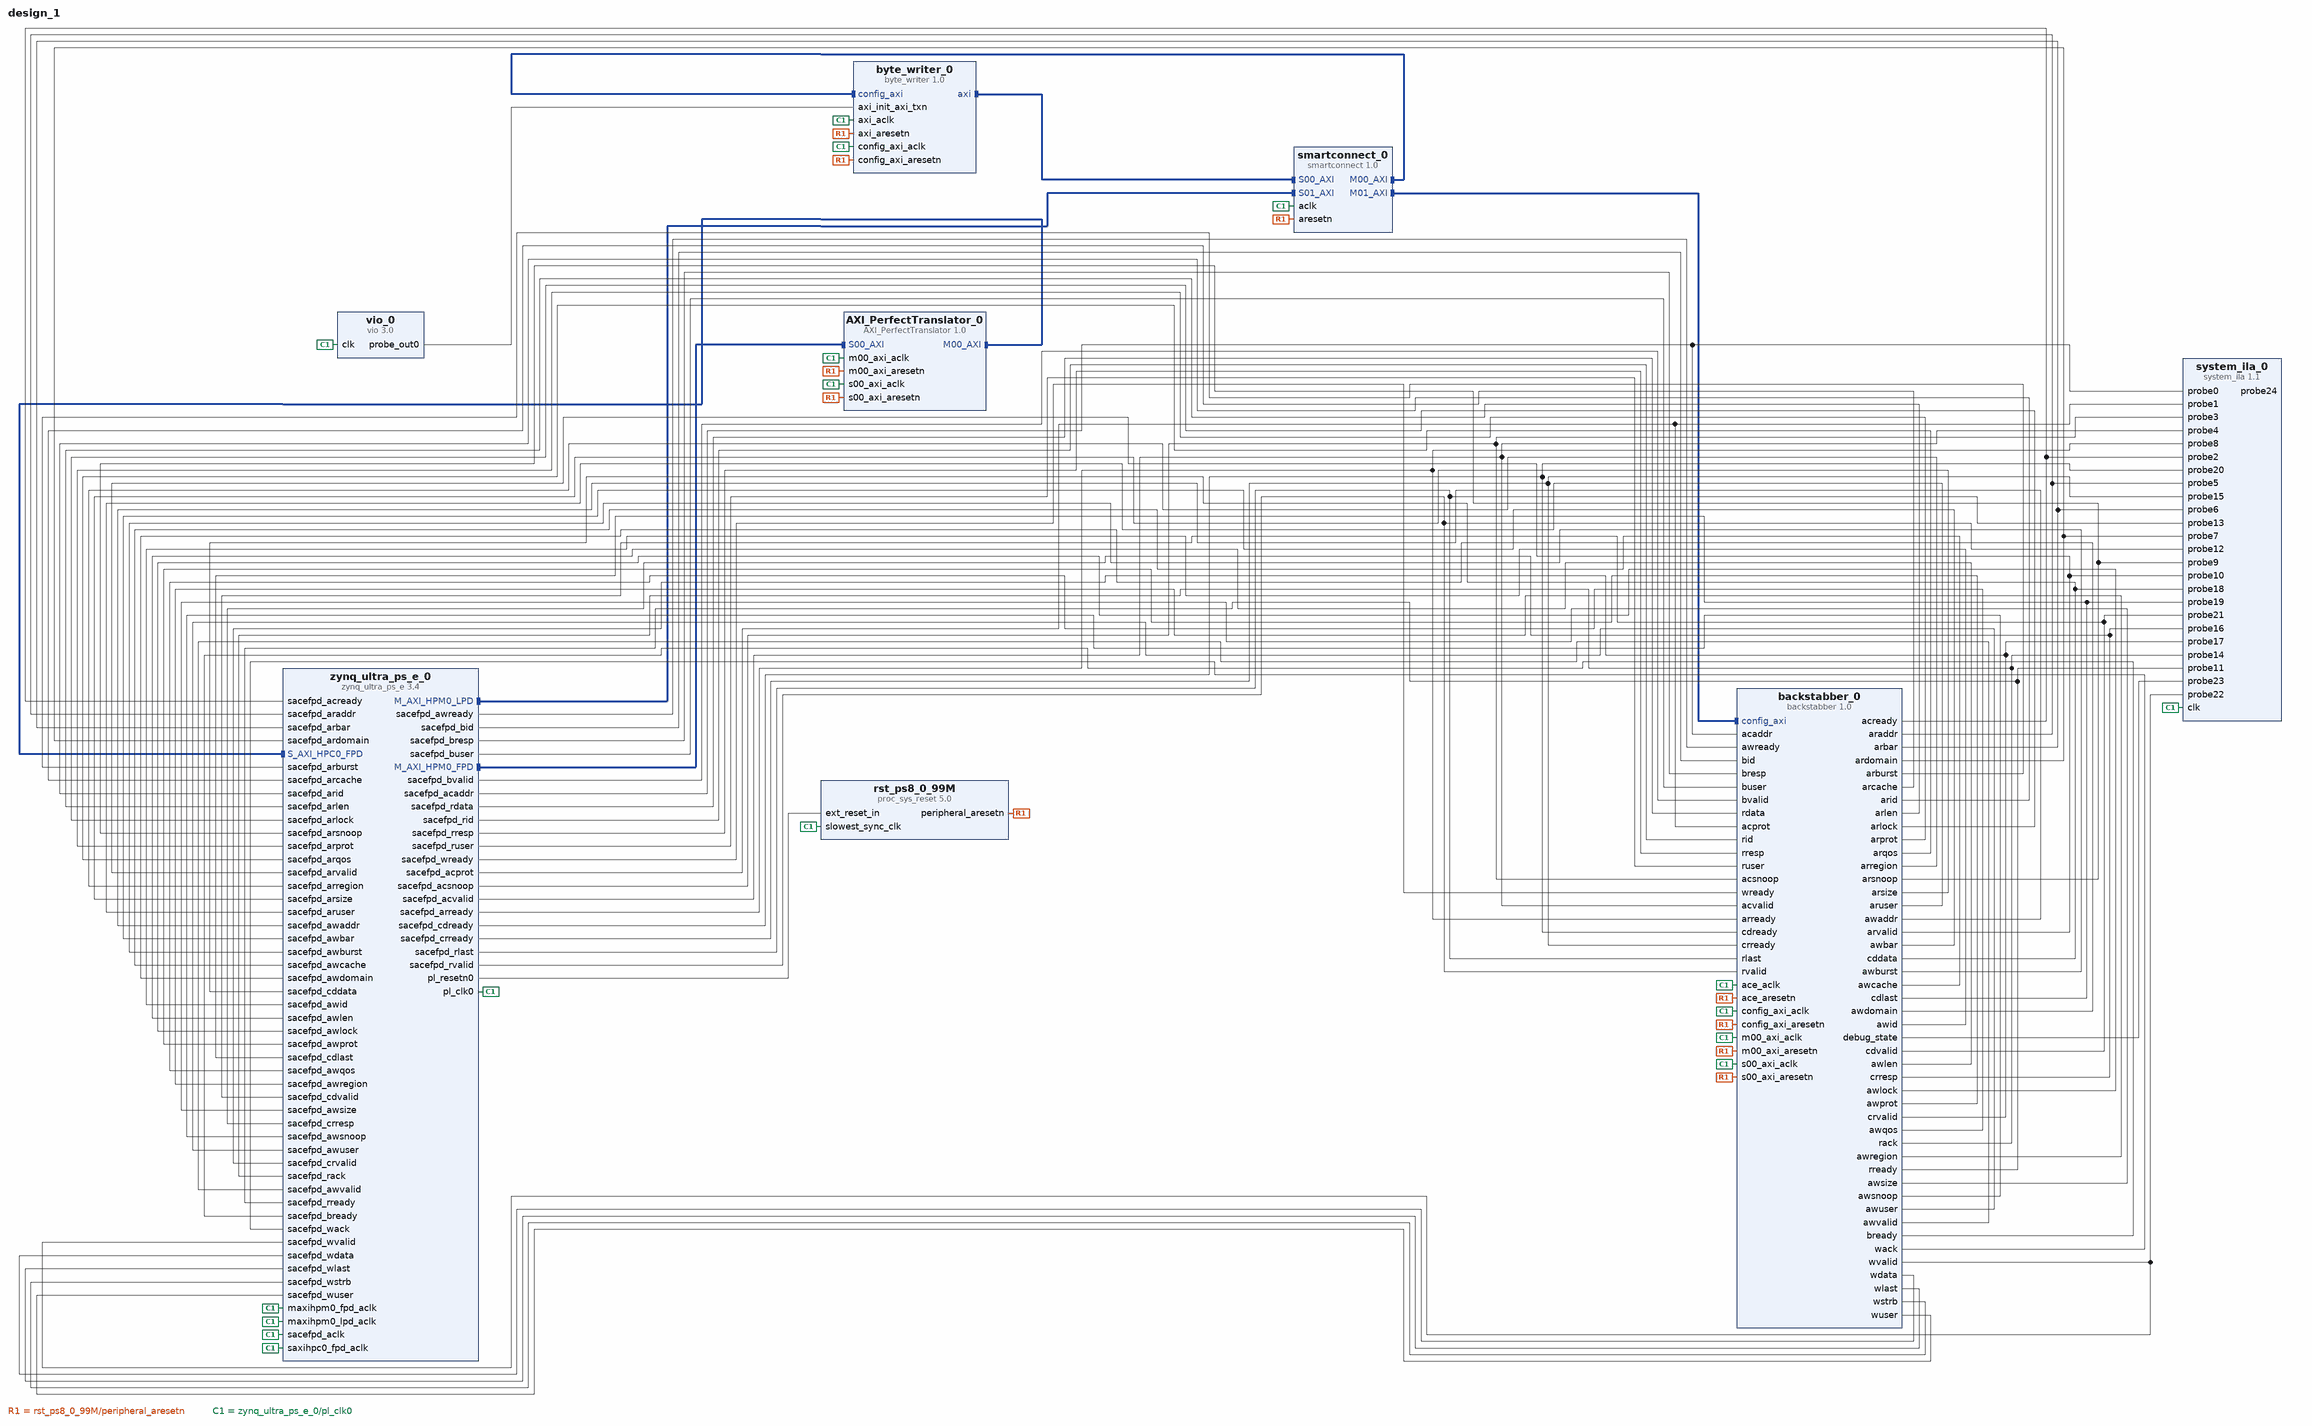
[diagram p0: block diagram of the top level]
# Vivado block design design_1, xczu9eg-ffvb1156-2-e, Vivado 2022.1
create_bd_design design_1

create_bd_cell -type ip -vlnv user.org:user:AXI_PerfectTranslator:1.0 AXI_PerfectTranslator_0
set_property -dict {CONFIG.C_M00_AXI_ID_WIDTH 6} [get_bd_cells AXI_PerfectTranslator_0]
create_bd_cell -type ip -vlnv user.org:user:backstabber:1.0 backstabber_0
set_property -dict {CONFIG.C_Config_AXI_DATA_WIDTH 128 CONFIG.QUEUE_DEPTH 2 CONFIG.WRITER 0} [get_bd_cells backstabber_0]
create_bd_cell -type ip -vlnv user.org:user:byte_writer:1.0 byte_writer_0
create_bd_cell -type ip -vlnv xilinx.com:ip:proc_sys_reset:5.0 rst_ps8_0_99M
create_bd_cell -type ip -vlnv xilinx.com:ip:smartconnect:1.0 smartconnect_0
set_property -dict {CONFIG.NUM_MI 2} [get_bd_cells smartconnect_0]
create_bd_cell -type ip -vlnv xilinx.com:ip:system_ila:1.1 system_ila_0
set_property -dict {CONFIG.C_DATA_DEPTH 65536 CONFIG.C_MON_TYPE NATIVE CONFIG.C_NUM_OF_PROBES 25} [get_bd_cells system_ila_0]
create_bd_cell -type ip -vlnv xilinx.com:ip:vio:3.0 vio_0
set_property -dict {CONFIG.C_NUM_PROBE_IN 0} [get_bd_cells vio_0]
create_bd_cell -type ip -vlnv xilinx.com:ip:zynq_ultra_ps_e:3.4 zynq_ultra_ps_e_0
set_property -dict [list \
  CONFIG.PSU_BANK_0_IO_STANDARD LVCMOS18 \
  CONFIG.PSU_BANK_1_IO_STANDARD LVCMOS18 \
  CONFIG.PSU_BANK_2_IO_STANDARD LVCMOS18 \
  CONFIG.PSU_USB3__DUAL_CLOCK_ENABLE 1 \
  CONFIG.PSU__CAN1__PERIPHERAL__ENABLE 1 \
  CONFIG.PSU__CAN1__PERIPHERAL__IO {MIO 24 .. 25} \
  CONFIG.PSU__CRF_APB__ACPU_CTRL__FREQMHZ 1200 \
  CONFIG.PSU__CRF_APB__ACPU_CTRL__SRCSEL APLL \
  CONFIG.PSU__CRF_APB__APLL_CTRL__SRCSEL PSS_REF_CLK \
  CONFIG.PSU__CRF_APB__DBG_FPD_CTRL__FREQMHZ 250 \
  CONFIG.PSU__CRF_APB__DBG_FPD_CTRL__SRCSEL IOPLL \
  CONFIG.PSU__CRF_APB__DBG_TRACE_CTRL__FREQMHZ 250 \
  CONFIG.PSU__CRF_APB__DBG_TRACE_CTRL__SRCSEL IOPLL \
  CONFIG.PSU__CRF_APB__DBG_TSTMP_CTRL__FREQMHZ 250 \
  CONFIG.PSU__CRF_APB__DBG_TSTMP_CTRL__SRCSEL IOPLL \
  CONFIG.PSU__CRF_APB__DDR_CTRL__FREQMHZ 1067 \
  CONFIG.PSU__CRF_APB__DDR_CTRL__SRCSEL DPLL \
  CONFIG.PSU__CRF_APB__DPDMA_REF_CTRL__FREQMHZ 600 \
  CONFIG.PSU__CRF_APB__DPDMA_REF_CTRL__SRCSEL APLL \
  CONFIG.PSU__CRF_APB__DPLL_CTRL__SRCSEL PSS_REF_CLK \
  CONFIG.PSU__CRF_APB__DP_AUDIO_REF_CTRL__SRCSEL RPLL \
  CONFIG.PSU__CRF_APB__DP_STC_REF_CTRL__SRCSEL RPLL \
  CONFIG.PSU__CRF_APB__DP_VIDEO_REF_CTRL__SRCSEL VPLL \
  CONFIG.PSU__CRF_APB__GDMA_REF_CTRL__FREQMHZ 600 \
  CONFIG.PSU__CRF_APB__GDMA_REF_CTRL__SRCSEL APLL \
  CONFIG.PSU__CRF_APB__GPU_REF_CTRL__FREQMHZ 500 \
  CONFIG.PSU__CRF_APB__GPU_REF_CTRL__SRCSEL IOPLL \
  CONFIG.PSU__CRF_APB__TOPSW_LSBUS_CTRL__FREQMHZ 100 \
  CONFIG.PSU__CRF_APB__TOPSW_LSBUS_CTRL__SRCSEL IOPLL \
  CONFIG.PSU__CRF_APB__TOPSW_MAIN_CTRL__FREQMHZ 533.33 \
  CONFIG.PSU__CRF_APB__TOPSW_MAIN_CTRL__SRCSEL DPLL \
  CONFIG.PSU__CRF_APB__VPLL_CTRL__SRCSEL PSS_REF_CLK \
  CONFIG.PSU__CRL_APB__ADMA_REF_CTRL__FREQMHZ 500 \
  CONFIG.PSU__CRL_APB__ADMA_REF_CTRL__SRCSEL IOPLL \
  CONFIG.PSU__CRL_APB__CAN1_REF_CTRL__FREQMHZ 100 \
  CONFIG.PSU__CRL_APB__CAN1_REF_CTRL__SRCSEL IOPLL \
  CONFIG.PSU__CRL_APB__CPU_R5_CTRL__FREQMHZ 500 \
  CONFIG.PSU__CRL_APB__CPU_R5_CTRL__SRCSEL IOPLL \
  CONFIG.PSU__CRL_APB__DBG_LPD_CTRL__FREQMHZ 250 \
  CONFIG.PSU__CRL_APB__DBG_LPD_CTRL__SRCSEL IOPLL \
  CONFIG.PSU__CRL_APB__GEM3_REF_CTRL__FREQMHZ 125 \
  CONFIG.PSU__CRL_APB__GEM3_REF_CTRL__SRCSEL IOPLL \
  CONFIG.PSU__CRL_APB__I2C0_REF_CTRL__FREQMHZ 100 \
  CONFIG.PSU__CRL_APB__I2C0_REF_CTRL__SRCSEL IOPLL \
  CONFIG.PSU__CRL_APB__I2C1_REF_CTRL__FREQMHZ 100 \
  CONFIG.PSU__CRL_APB__I2C1_REF_CTRL__SRCSEL IOPLL \
  CONFIG.PSU__CRL_APB__IOPLL_CTRL__SRCSEL PSS_REF_CLK \
  CONFIG.PSU__CRL_APB__IOU_SWITCH_CTRL__FREQMHZ 250 \
  CONFIG.PSU__CRL_APB__IOU_SWITCH_CTRL__SRCSEL IOPLL \
  CONFIG.PSU__CRL_APB__LPD_LSBUS_CTRL__FREQMHZ 100 \
  CONFIG.PSU__CRL_APB__LPD_LSBUS_CTRL__SRCSEL IOPLL \
  CONFIG.PSU__CRL_APB__LPD_SWITCH_CTRL__FREQMHZ 500 \
  CONFIG.PSU__CRL_APB__LPD_SWITCH_CTRL__SRCSEL IOPLL \
  CONFIG.PSU__CRL_APB__PCAP_CTRL__FREQMHZ 200 \
  CONFIG.PSU__CRL_APB__PCAP_CTRL__SRCSEL IOPLL \
  CONFIG.PSU__CRL_APB__PL0_REF_CTRL__FREQMHZ 150 \
  CONFIG.PSU__CRL_APB__PL0_REF_CTRL__SRCSEL IOPLL \
  CONFIG.PSU__CRL_APB__QSPI_REF_CTRL__FREQMHZ 125 \
  CONFIG.PSU__CRL_APB__QSPI_REF_CTRL__SRCSEL IOPLL \
  CONFIG.PSU__CRL_APB__RPLL_CTRL__SRCSEL PSS_REF_CLK \
  CONFIG.PSU__CRL_APB__SDIO1_REF_CTRL__FREQMHZ 200 \
  CONFIG.PSU__CRL_APB__SDIO1_REF_CTRL__SRCSEL IOPLL \
  CONFIG.PSU__CRL_APB__TIMESTAMP_REF_CTRL__FREQMHZ 100 \
  CONFIG.PSU__CRL_APB__TIMESTAMP_REF_CTRL__SRCSEL IOPLL \
  CONFIG.PSU__CRL_APB__UART0_REF_CTRL__FREQMHZ 100 \
  CONFIG.PSU__CRL_APB__UART0_REF_CTRL__SRCSEL IOPLL \
  CONFIG.PSU__CRL_APB__UART1_REF_CTRL__FREQMHZ 100 \
  CONFIG.PSU__CRL_APB__UART1_REF_CTRL__SRCSEL IOPLL \
  CONFIG.PSU__CRL_APB__USB0_BUS_REF_CTRL__FREQMHZ 250 \
  CONFIG.PSU__CRL_APB__USB0_BUS_REF_CTRL__SRCSEL IOPLL \
  CONFIG.PSU__CRL_APB__USB3_DUAL_REF_CTRL__FREQMHZ 20 \
  CONFIG.PSU__CRL_APB__USB3_DUAL_REF_CTRL__SRCSEL IOPLL \
  CONFIG.PSU__CRL_APB__USB3__ENABLE 1 \
  CONFIG.PSU__CSUPMU__PERIPHERAL__VALID 1 \
  CONFIG.PSU__DDRC__BUS_WIDTH {64 Bit} \
  CONFIG.PSU__DDRC__COMPONENTS UDIMM \
  CONFIG.PSU__DDRC__DEVICE_CAPACITY {4096 MBits} \
  CONFIG.PSU__DDRC__DRAM_WIDTH {8 Bits} \
  CONFIG.PSU__DDRC__ECC Disabled \
  CONFIG.PSU__DDRC__MEMORY_TYPE {DDR 4} \
  CONFIG.PSU__DDRC__SPEED_BIN DDR4_2133P \
  CONFIG.PSU__DDR_HIGH_ADDRESS_GUI_ENABLE 1 \
  CONFIG.PSU__DDR__INTERFACE__FREQMHZ 533.500 \
  CONFIG.PSU__DISPLAYPORT__LANE0__ENABLE 1 \
  CONFIG.PSU__DISPLAYPORT__LANE0__IO {GT Lane1} \
  CONFIG.PSU__DISPLAYPORT__LANE1__ENABLE 0 \
  CONFIG.PSU__DISPLAYPORT__PERIPHERAL__ENABLE 1 \
  CONFIG.PSU__DLL__ISUSED 1 \
  CONFIG.PSU__DPAUX__PERIPHERAL__ENABLE 1 \
  CONFIG.PSU__DPAUX__PERIPHERAL__IO {MIO 27 .. 30} \
  CONFIG.PSU__DP__LANE_SEL {Single Lower} \
  CONFIG.PSU__DP__REF_CLK_FREQ 27 \
  CONFIG.PSU__DP__REF_CLK_SEL {Ref Clk3} \
  CONFIG.PSU__ENET3__FIFO__ENABLE 0 \
  CONFIG.PSU__ENET3__GRP_MDIO__ENABLE 1 \
  CONFIG.PSU__ENET3__GRP_MDIO__IO {MIO 76 .. 77} \
  CONFIG.PSU__ENET3__PERIPHERAL__ENABLE 1 \
  CONFIG.PSU__ENET3__PERIPHERAL__IO {MIO 64 .. 75} \
  CONFIG.PSU__ENET3__PTP__ENABLE 0 \
  CONFIG.PSU__ENET3__TSU__ENABLE 0 \
  CONFIG.PSU__FPGA_PL0_ENABLE 1 \
  CONFIG.PSU__GEM3_COHERENCY 0 \
  CONFIG.PSU__GEM3_ROUTE_THROUGH_FPD 0 \
  CONFIG.PSU__GEM__TSU__ENABLE 0 \
  CONFIG.PSU__GPIO0_MIO__IO {MIO 0 .. 25} \
  CONFIG.PSU__GPIO0_MIO__PERIPHERAL__ENABLE 1 \
  CONFIG.PSU__GPIO1_MIO__IO {MIO 26 .. 51} \
  CONFIG.PSU__GPIO1_MIO__PERIPHERAL__ENABLE 1 \
  CONFIG.PSU__GT__LINK_SPEED HBR \
  CONFIG.PSU__GT__PRE_EMPH_LVL_4 0 \
  CONFIG.PSU__GT__VLT_SWNG_LVL_4 0 \
  CONFIG.PSU__I2C0__PERIPHERAL__ENABLE 1 \
  CONFIG.PSU__I2C0__PERIPHERAL__IO {MIO 14 .. 15} \
  CONFIG.PSU__I2C1__PERIPHERAL__ENABLE 1 \
  CONFIG.PSU__I2C1__PERIPHERAL__IO {MIO 16 .. 17} \
  CONFIG.PSU__IOU_SLCR__IOU_TTC_APB_CLK__TTC0_SEL APB \
  CONFIG.PSU__IOU_SLCR__IOU_TTC_APB_CLK__TTC1_SEL APB \
  CONFIG.PSU__IOU_SLCR__IOU_TTC_APB_CLK__TTC2_SEL APB \
  CONFIG.PSU__IOU_SLCR__IOU_TTC_APB_CLK__TTC3_SEL APB \
  CONFIG.PSU__MAXIGP0__DATA_WIDTH 128 \
  CONFIG.PSU__MAXIGP2__DATA_WIDTH 128 \
  CONFIG.PSU__OVERRIDE__BASIC_CLOCK 0 \
  CONFIG.PSU__PCIE__BAR0_VAL 0x0 \
  CONFIG.PSU__PCIE__BAR1_VAL 0x0 \
  CONFIG.PSU__PCIE__BAR2_VAL 0x0 \
  CONFIG.PSU__PCIE__BAR3_VAL 0x0 \
  CONFIG.PSU__PCIE__BAR4_VAL 0x0 \
  CONFIG.PSU__PCIE__BAR5_VAL 0x0 \
  CONFIG.PSU__PCIE__CLASS_CODE_BASE 0x06 \
  CONFIG.PSU__PCIE__CLASS_CODE_INTERFACE 0x0 \
  CONFIG.PSU__PCIE__CLASS_CODE_SUB 0x4 \
  CONFIG.PSU__PCIE__CLASS_CODE_VALUE 0x60400 \
  CONFIG.PSU__PCIE__CRS_SW_VISIBILITY 1 \
  CONFIG.PSU__PCIE__DEVICE_ID 0xD021 \
  CONFIG.PSU__PCIE__DEVICE_PORT_TYPE {Root Port} \
  CONFIG.PSU__PCIE__EROM_VAL 0x0 \
  CONFIG.PSU__PCIE__LANE0__ENABLE 1 \
  CONFIG.PSU__PCIE__LANE0__IO {GT Lane0} \
  CONFIG.PSU__PCIE__LINK_SPEED {5.0 Gb/s} \
  CONFIG.PSU__PCIE__MAXIMUM_LINK_WIDTH x1 \
  CONFIG.PSU__PCIE__MAX_PAYLOAD_SIZE {256 bytes} \
  CONFIG.PSU__PCIE__PERIPHERAL__ENABLE 1 \
  CONFIG.PSU__PCIE__PERIPHERAL__ENDPOINT_ENABLE 0 \
  CONFIG.PSU__PCIE__PERIPHERAL__ROOTPORT_ENABLE 1 \
  CONFIG.PSU__PCIE__PERIPHERAL__ROOTPORT_IO {MIO 31} \
  CONFIG.PSU__PCIE__REF_CLK_FREQ 100 \
  CONFIG.PSU__PCIE__REF_CLK_SEL {Ref Clk0} \
  CONFIG.PSU__PCIE__REVISION_ID 0x0 \
  CONFIG.PSU__PCIE__SUBSYSTEM_ID 0x7 \
  CONFIG.PSU__PCIE__SUBSYSTEM_VENDOR_ID 0x10EE \
  CONFIG.PSU__PCIE__VENDOR_ID 0x10EE \
  CONFIG.PSU__PMU_COHERENCY 0 \
  CONFIG.PSU__PMU__AIBACK__ENABLE 0 \
  CONFIG.PSU__PMU__EMIO_GPI__ENABLE 0 \
  CONFIG.PSU__PMU__EMIO_GPO__ENABLE 0 \
  CONFIG.PSU__PMU__GPI0__ENABLE 0 \
  CONFIG.PSU__PMU__GPI1__ENABLE 0 \
  CONFIG.PSU__PMU__GPI2__ENABLE 0 \
  CONFIG.PSU__PMU__GPI3__ENABLE 0 \
  CONFIG.PSU__PMU__GPI4__ENABLE 0 \
  CONFIG.PSU__PMU__GPI5__ENABLE 0 \
  CONFIG.PSU__PMU__GPO0__ENABLE 1 \
  CONFIG.PSU__PMU__GPO0__IO {MIO 32} \
  CONFIG.PSU__PMU__GPO1__ENABLE 1 \
  CONFIG.PSU__PMU__GPO1__IO {MIO 33} \
  CONFIG.PSU__PMU__GPO2__ENABLE 1 \
  CONFIG.PSU__PMU__GPO2__IO {MIO 34} \
  CONFIG.PSU__PMU__GPO2__POLARITY low \
  CONFIG.PSU__PMU__GPO3__ENABLE 1 \
  CONFIG.PSU__PMU__GPO3__IO {MIO 35} \
  CONFIG.PSU__PMU__GPO3__POLARITY low \
  CONFIG.PSU__PMU__GPO4__ENABLE 1 \
  CONFIG.PSU__PMU__GPO4__IO {MIO 36} \
  CONFIG.PSU__PMU__GPO4__POLARITY low \
  CONFIG.PSU__PMU__GPO5__ENABLE 1 \
  CONFIG.PSU__PMU__GPO5__IO {MIO 37} \
  CONFIG.PSU__PMU__GPO5__POLARITY low \
  CONFIG.PSU__PMU__PERIPHERAL__ENABLE 1 \
  CONFIG.PSU__PMU__PLERROR__ENABLE 0 \
  CONFIG.PSU__PRESET_APPLIED 1 \
  CONFIG.PSU__PSS_REF_CLK__FREQMHZ 33.330 \
  CONFIG.PSU__QSPI_COHERENCY 0 \
  CONFIG.PSU__QSPI_ROUTE_THROUGH_FPD 0 \
  CONFIG.PSU__QSPI__GRP_FBCLK__ENABLE 1 \
  CONFIG.PSU__QSPI__GRP_FBCLK__IO {MIO 6} \
  CONFIG.PSU__QSPI__PERIPHERAL__DATA_MODE x4 \
  CONFIG.PSU__QSPI__PERIPHERAL__ENABLE 1 \
  CONFIG.PSU__QSPI__PERIPHERAL__IO {MIO 0 .. 12} \
  CONFIG.PSU__QSPI__PERIPHERAL__MODE {Dual Parallel} \
  CONFIG.PSU__SATA__LANE1__IO {GT Lane3} \
  CONFIG.PSU__SATA__PERIPHERAL__ENABLE 1 \
  CONFIG.PSU__SATA__REF_CLK_FREQ 125 \
  CONFIG.PSU__SATA__REF_CLK_SEL {Ref Clk1} \
  CONFIG.PSU__SD1_COHERENCY 0 \
  CONFIG.PSU__SD1_ROUTE_THROUGH_FPD 0 \
  CONFIG.PSU__SD1__CLK_100_SDR_OTAP_DLY 0x3 \
  CONFIG.PSU__SD1__CLK_200_SDR_OTAP_DLY 0x3 \
  CONFIG.PSU__SD1__CLK_50_DDR_ITAP_DLY 0x3D \
  CONFIG.PSU__SD1__CLK_50_DDR_OTAP_DLY 0x4 \
  CONFIG.PSU__SD1__CLK_50_SDR_ITAP_DLY 0x15 \
  CONFIG.PSU__SD1__CLK_50_SDR_OTAP_DLY 0x5 \
  CONFIG.PSU__SD1__DATA_TRANSFER_MODE 8Bit \
  CONFIG.PSU__SD1__GRP_CD__ENABLE 1 \
  CONFIG.PSU__SD1__GRP_CD__IO {MIO 45} \
  CONFIG.PSU__SD1__GRP_POW__ENABLE 0 \
  CONFIG.PSU__SD1__GRP_WP__ENABLE 1 \
  CONFIG.PSU__SD1__GRP_WP__IO {MIO 44} \
  CONFIG.PSU__SD1__PERIPHERAL__ENABLE 1 \
  CONFIG.PSU__SD1__PERIPHERAL__IO {MIO 39 .. 51} \
  CONFIG.PSU__SD1__SLOT_TYPE {SD 3.0} \
  CONFIG.PSU__SWDT0__CLOCK__ENABLE 0 \
  CONFIG.PSU__SWDT0__PERIPHERAL__ENABLE 1 \
  CONFIG.PSU__SWDT0__RESET__ENABLE 0 \
  CONFIG.PSU__SWDT1__CLOCK__ENABLE 0 \
  CONFIG.PSU__SWDT1__PERIPHERAL__ENABLE 1 \
  CONFIG.PSU__SWDT1__RESET__ENABLE 0 \
  CONFIG.PSU__TSU__BUFG_PORT_PAIR 0 \
  CONFIG.PSU__TTC0__CLOCK__ENABLE 0 \
  CONFIG.PSU__TTC0__PERIPHERAL__ENABLE 1 \
  CONFIG.PSU__TTC0__WAVEOUT__ENABLE 0 \
  CONFIG.PSU__TTC1__CLOCK__ENABLE 0 \
  CONFIG.PSU__TTC1__PERIPHERAL__ENABLE 1 \
  CONFIG.PSU__TTC1__WAVEOUT__ENABLE 0 \
  CONFIG.PSU__TTC2__CLOCK__ENABLE 0 \
  CONFIG.PSU__TTC2__PERIPHERAL__ENABLE 1 \
  CONFIG.PSU__TTC2__WAVEOUT__ENABLE 0 \
  CONFIG.PSU__TTC3__CLOCK__ENABLE 0 \
  CONFIG.PSU__TTC3__PERIPHERAL__ENABLE 1 \
  CONFIG.PSU__TTC3__WAVEOUT__ENABLE 0 \
  CONFIG.PSU__UART0__BAUD_RATE 115200 \
  CONFIG.PSU__UART0__MODEM__ENABLE 0 \
  CONFIG.PSU__UART0__PERIPHERAL__ENABLE 1 \
  CONFIG.PSU__UART0__PERIPHERAL__IO {MIO 18 .. 19} \
  CONFIG.PSU__UART1__BAUD_RATE 115200 \
  CONFIG.PSU__UART1__MODEM__ENABLE 0 \
  CONFIG.PSU__UART1__PERIPHERAL__ENABLE 1 \
  CONFIG.PSU__UART1__PERIPHERAL__IO {MIO 20 .. 21} \
  CONFIG.PSU__USB0_COHERENCY 0 \
  CONFIG.PSU__USB0__PERIPHERAL__ENABLE 1 \
  CONFIG.PSU__USB0__PERIPHERAL__IO {MIO 52 .. 63} \
  CONFIG.PSU__USB0__REF_CLK_FREQ 26 \
  CONFIG.PSU__USB0__REF_CLK_SEL {Ref Clk2} \
  CONFIG.PSU__USB2_0__EMIO__ENABLE 0 \
  CONFIG.PSU__USB3_0__EMIO__ENABLE 0 \
  CONFIG.PSU__USB3_0__PERIPHERAL__ENABLE 1 \
  CONFIG.PSU__USB3_0__PERIPHERAL__IO {GT Lane2} \
  CONFIG.PSU__USB__RESET__MODE {Boot Pin} \
  CONFIG.PSU__USB__RESET__POLARITY {Active Low} \
  CONFIG.PSU__USE__IRQ0 1 \
  CONFIG.PSU__USE__M_AXI_GP0 1 \
  CONFIG.PSU__USE__M_AXI_GP1 0 \
  CONFIG.PSU__USE__M_AXI_GP2 1 \
  CONFIG.PSU__USE__S_AXI_ACE 1 \
  CONFIG.PSU__USE__S_AXI_GP0 1 \
] [get_bd_cells zynq_ultra_ps_e_0]
# 114 more settings of zynq_ultra_ps_e_0 are not shown: defaults, MIO pin electricals, DDR timing, and values the tool derives

# ---- connections ----

connect_bd_intf_net [get_bd_intf_pins AXI_PerfectTranslator_0/M00_AXI] [get_bd_intf_pins zynq_ultra_ps_e_0/S_AXI_HPC0_FPD]
connect_bd_intf_net [get_bd_intf_pins byte_writer_0/axi] [get_bd_intf_pins smartconnect_0/S00_AXI]
connect_bd_intf_net -intf_net smartconnect_0_M00_AXI [get_bd_intf_pins byte_writer_0/config_axi] [get_bd_intf_pins smartconnect_0/M00_AXI]
connect_bd_intf_net [get_bd_intf_pins backstabber_0/config_axi] [get_bd_intf_pins smartconnect_0/M01_AXI]
connect_bd_intf_net [get_bd_intf_pins AXI_PerfectTranslator_0/S00_AXI] [get_bd_intf_pins zynq_ultra_ps_e_0/M_AXI_HPM0_FPD]
connect_bd_intf_net [get_bd_intf_pins smartconnect_0/S01_AXI] [get_bd_intf_pins zynq_ultra_ps_e_0/M_AXI_HPM0_LPD]
connect_bd_net -net backstabber_0_acready [get_bd_pins backstabber_0/acready] \
  [get_bd_pins system_ila_0/probe2] [get_bd_pins zynq_ultra_ps_e_0/sacefpd_acready]
connect_bd_net [get_bd_pins backstabber_0/araddr] [get_bd_pins system_ila_0/probe5] [get_bd_pins zynq_ultra_ps_e_0/sacefpd_araddr]
connect_bd_net [get_bd_pins backstabber_0/arbar] [get_bd_pins system_ila_0/probe6] [get_bd_pins zynq_ultra_ps_e_0/sacefpd_arbar]
connect_bd_net [get_bd_pins backstabber_0/arburst] [get_bd_pins zynq_ultra_ps_e_0/sacefpd_arburst]
connect_bd_net [get_bd_pins backstabber_0/arcache] [get_bd_pins zynq_ultra_ps_e_0/sacefpd_arcache]
connect_bd_net [get_bd_pins backstabber_0/ardomain] [get_bd_pins system_ila_0/probe7] [get_bd_pins zynq_ultra_ps_e_0/sacefpd_ardomain]
connect_bd_net [get_bd_pins backstabber_0/arid] [get_bd_pins zynq_ultra_ps_e_0/sacefpd_arid]
connect_bd_net [get_bd_pins backstabber_0/arlen] [get_bd_pins zynq_ultra_ps_e_0/sacefpd_arlen]
connect_bd_net [get_bd_pins backstabber_0/arlock] [get_bd_pins zynq_ultra_ps_e_0/sacefpd_arlock]
connect_bd_net [get_bd_pins backstabber_0/arprot] [get_bd_pins zynq_ultra_ps_e_0/sacefpd_arprot]
connect_bd_net [get_bd_pins backstabber_0/arqos] [get_bd_pins zynq_ultra_ps_e_0/sacefpd_arqos]
connect_bd_net [get_bd_pins backstabber_0/arregion] [get_bd_pins zynq_ultra_ps_e_0/sacefpd_arregion]
connect_bd_net [get_bd_pins backstabber_0/arsize] [get_bd_pins zynq_ultra_ps_e_0/sacefpd_arsize]
connect_bd_net [get_bd_pins backstabber_0/arsnoop] [get_bd_pins system_ila_0/probe9] [get_bd_pins zynq_ultra_ps_e_0/sacefpd_arsnoop]
connect_bd_net [get_bd_pins backstabber_0/aruser] [get_bd_pins zynq_ultra_ps_e_0/sacefpd_aruser]
connect_bd_net [get_bd_pins backstabber_0/arvalid] [get_bd_pins system_ila_0/probe10] [get_bd_pins zynq_ultra_ps_e_0/sacefpd_arvalid]
connect_bd_net [get_bd_pins backstabber_0/awaddr] [get_bd_pins zynq_ultra_ps_e_0/sacefpd_awaddr]
connect_bd_net [get_bd_pins backstabber_0/awbar] [get_bd_pins zynq_ultra_ps_e_0/sacefpd_awbar]
connect_bd_net [get_bd_pins backstabber_0/awburst] [get_bd_pins zynq_ultra_ps_e_0/sacefpd_awburst]
connect_bd_net [get_bd_pins backstabber_0/awcache] [get_bd_pins zynq_ultra_ps_e_0/sacefpd_awcache]
connect_bd_net [get_bd_pins backstabber_0/awdomain] [get_bd_pins zynq_ultra_ps_e_0/sacefpd_awdomain]
connect_bd_net [get_bd_pins backstabber_0/awid] [get_bd_pins zynq_ultra_ps_e_0/sacefpd_awid]
connect_bd_net [get_bd_pins backstabber_0/awlen] [get_bd_pins zynq_ultra_ps_e_0/sacefpd_awlen]
connect_bd_net [get_bd_pins backstabber_0/awlock] [get_bd_pins zynq_ultra_ps_e_0/sacefpd_awlock]
connect_bd_net [get_bd_pins backstabber_0/awprot] [get_bd_pins zynq_ultra_ps_e_0/sacefpd_awprot]
connect_bd_net [get_bd_pins backstabber_0/awqos] [get_bd_pins zynq_ultra_ps_e_0/sacefpd_awqos]
connect_bd_net [get_bd_pins backstabber_0/awregion] [get_bd_pins zynq_ultra_ps_e_0/sacefpd_awregion]
connect_bd_net [get_bd_pins backstabber_0/awsize] [get_bd_pins zynq_ultra_ps_e_0/sacefpd_awsize]
connect_bd_net [get_bd_pins backstabber_0/awsnoop] [get_bd_pins zynq_ultra_ps_e_0/sacefpd_awsnoop]
connect_bd_net [get_bd_pins backstabber_0/awuser] [get_bd_pins zynq_ultra_ps_e_0/sacefpd_awuser]
connect_bd_net [get_bd_pins backstabber_0/awvalid] [get_bd_pins zynq_ultra_ps_e_0/sacefpd_awvalid]
connect_bd_net [get_bd_pins backstabber_0/bready] [get_bd_pins zynq_ultra_ps_e_0/sacefpd_bready]
connect_bd_net [get_bd_pins backstabber_0/cddata] [get_bd_pins system_ila_0/probe18] [get_bd_pins zynq_ultra_ps_e_0/sacefpd_cddata]
connect_bd_net [get_bd_pins backstabber_0/cdlast] [get_bd_pins system_ila_0/probe19] [get_bd_pins zynq_ultra_ps_e_0/sacefpd_cdlast]
connect_bd_net [get_bd_pins backstabber_0/cdvalid] [get_bd_pins system_ila_0/probe21] [get_bd_pins zynq_ultra_ps_e_0/sacefpd_cdvalid]
connect_bd_net -net backstabber_0_crresp [get_bd_pins backstabber_0/crresp] \
  [get_bd_pins system_ila_0/probe16] [get_bd_pins zynq_ultra_ps_e_0/sacefpd_crresp]
connect_bd_net -net backstabber_0_crvalid [get_bd_pins backstabber_0/crvalid] \
  [get_bd_pins system_ila_0/probe17] [get_bd_pins zynq_ultra_ps_e_0/sacefpd_crvalid]
# net backstabber_0_debug_reply_state has one end: system_ila_0/probe24
connect_bd_net [get_bd_pins backstabber_0/debug_state] [get_bd_pins system_ila_0/probe23]
connect_bd_net [get_bd_pins backstabber_0/rack] [get_bd_pins system_ila_0/probe14] [get_bd_pins zynq_ultra_ps_e_0/sacefpd_rack]
connect_bd_net [get_bd_pins backstabber_0/rready] [get_bd_pins system_ila_0/probe11] [get_bd_pins zynq_ultra_ps_e_0/sacefpd_rready]
connect_bd_net -net backstabber_0_wack [get_bd_pins backstabber_0/wack] [get_bd_pins zynq_ultra_ps_e_0/sacefpd_wack]
connect_bd_net [get_bd_pins backstabber_0/wdata] [get_bd_pins zynq_ultra_ps_e_0/sacefpd_wdata]
connect_bd_net [get_bd_pins backstabber_0/wlast] [get_bd_pins zynq_ultra_ps_e_0/sacefpd_wlast]
connect_bd_net [get_bd_pins backstabber_0/wstrb] [get_bd_pins zynq_ultra_ps_e_0/sacefpd_wstrb]
connect_bd_net [get_bd_pins backstabber_0/wuser] [get_bd_pins zynq_ultra_ps_e_0/sacefpd_wuser]
connect_bd_net [get_bd_pins backstabber_0/wvalid] [get_bd_pins system_ila_0/probe22] [get_bd_pins zynq_ultra_ps_e_0/sacefpd_wvalid]
connect_bd_net [get_bd_pins rst_ps8_0_99M/peripheral_aresetn] \
  [get_bd_pins AXI_PerfectTranslator_0/m00_axi_aresetn] [get_bd_pins AXI_PerfectTranslator_0/s00_axi_aresetn] \
  [get_bd_pins backstabber_0/ace_aresetn] [get_bd_pins backstabber_0/config_axi_aresetn] \
  [get_bd_pins backstabber_0/m00_axi_aresetn] [get_bd_pins backstabber_0/s00_axi_aresetn] \
  [get_bd_pins byte_writer_0/axi_aresetn] [get_bd_pins byte_writer_0/config_axi_aresetn] [get_bd_pins smartconnect_0/aresetn]
connect_bd_net [get_bd_pins vio_0/probe_out0] [get_bd_pins byte_writer_0/axi_init_axi_txn]
connect_bd_net [get_bd_pins zynq_ultra_ps_e_0/pl_clk0] \
  [get_bd_pins AXI_PerfectTranslator_0/m00_axi_aclk] [get_bd_pins AXI_PerfectTranslator_0/s00_axi_aclk] \
  [get_bd_pins backstabber_0/ace_aclk] [get_bd_pins backstabber_0/config_axi_aclk] [get_bd_pins backstabber_0/m00_axi_aclk] \
  [get_bd_pins backstabber_0/s00_axi_aclk] [get_bd_pins byte_writer_0/axi_aclk] [get_bd_pins byte_writer_0/config_axi_aclk] \
  [get_bd_pins rst_ps8_0_99M/slowest_sync_clk] [get_bd_pins smartconnect_0/aclk] [get_bd_pins system_ila_0/clk] \
  [get_bd_pins vio_0/clk] [get_bd_pins zynq_ultra_ps_e_0/maxihpm0_fpd_aclk] [get_bd_pins zynq_ultra_ps_e_0/maxihpm0_lpd_aclk] \
  [get_bd_pins zynq_ultra_ps_e_0/sacefpd_aclk] [get_bd_pins zynq_ultra_ps_e_0/saxihpc0_fpd_aclk]
connect_bd_net [get_bd_pins zynq_ultra_ps_e_0/pl_resetn0] [get_bd_pins rst_ps8_0_99M/ext_reset_in]
connect_bd_net [get_bd_pins zynq_ultra_ps_e_0/sacefpd_acaddr] [get_bd_pins backstabber_0/acaddr] [get_bd_pins system_ila_0/probe0]
connect_bd_net [get_bd_pins zynq_ultra_ps_e_0/sacefpd_acprot] [get_bd_pins backstabber_0/acprot] [get_bd_pins system_ila_0/probe1]
connect_bd_net [get_bd_pins zynq_ultra_ps_e_0/sacefpd_acsnoop] [get_bd_pins backstabber_0/acsnoop] [get_bd_pins system_ila_0/probe3]
connect_bd_net [get_bd_pins zynq_ultra_ps_e_0/sacefpd_acvalid] [get_bd_pins backstabber_0/acvalid] [get_bd_pins system_ila_0/probe4]
connect_bd_net [get_bd_pins zynq_ultra_ps_e_0/sacefpd_arready] [get_bd_pins backstabber_0/arready] [get_bd_pins system_ila_0/probe8]
connect_bd_net [get_bd_pins zynq_ultra_ps_e_0/sacefpd_awready] [get_bd_pins backstabber_0/awready]
connect_bd_net [get_bd_pins zynq_ultra_ps_e_0/sacefpd_bid] [get_bd_pins backstabber_0/bid]
connect_bd_net [get_bd_pins zynq_ultra_ps_e_0/sacefpd_bresp] [get_bd_pins backstabber_0/bresp]
connect_bd_net [get_bd_pins zynq_ultra_ps_e_0/sacefpd_buser] [get_bd_pins backstabber_0/buser]
connect_bd_net [get_bd_pins zynq_ultra_ps_e_0/sacefpd_bvalid] [get_bd_pins backstabber_0/bvalid]
connect_bd_net [get_bd_pins zynq_ultra_ps_e_0/sacefpd_cdready] [get_bd_pins backstabber_0/cdready] [get_bd_pins system_ila_0/probe20]
connect_bd_net [get_bd_pins zynq_ultra_ps_e_0/sacefpd_crready] [get_bd_pins backstabber_0/crready] [get_bd_pins system_ila_0/probe15]
connect_bd_net [get_bd_pins zynq_ultra_ps_e_0/sacefpd_rdata] [get_bd_pins backstabber_0/rdata]
connect_bd_net [get_bd_pins zynq_ultra_ps_e_0/sacefpd_rid] [get_bd_pins backstabber_0/rid]
connect_bd_net [get_bd_pins zynq_ultra_ps_e_0/sacefpd_rlast] [get_bd_pins backstabber_0/rlast] [get_bd_pins system_ila_0/probe13]
connect_bd_net [get_bd_pins zynq_ultra_ps_e_0/sacefpd_rresp] [get_bd_pins backstabber_0/rresp]
connect_bd_net [get_bd_pins zynq_ultra_ps_e_0/sacefpd_ruser] [get_bd_pins backstabber_0/ruser]
connect_bd_net [get_bd_pins zynq_ultra_ps_e_0/sacefpd_rvalid] [get_bd_pins backstabber_0/rvalid] [get_bd_pins system_ila_0/probe12]
connect_bd_net [get_bd_pins zynq_ultra_ps_e_0/sacefpd_wready] [get_bd_pins backstabber_0/wready]
set_property HDL_ATTRIBUTE.DEBUG true [get_bd_intf_nets smartconnect_0_M00_AXI]
set_property HDL_ATTRIBUTE.MARK_DEBUG true [get_bd_intf_nets smartconnect_0_M00_AXI]
set_property HDL_ATTRIBUTE.DEBUG true [get_bd_nets backstabber_0_acready]
set_property HDL_ATTRIBUTE.MARK_DEBUG true [get_bd_nets backstabber_0_acready]
set_property HDL_ATTRIBUTE.DEBUG true [get_bd_nets backstabber_0_crresp]
set_property HDL_ATTRIBUTE.MARK_DEBUG true [get_bd_nets backstabber_0_crresp]
set_property HDL_ATTRIBUTE.DEBUG true [get_bd_nets backstabber_0_crvalid]
set_property HDL_ATTRIBUTE.MARK_DEBUG true [get_bd_nets backstabber_0_crvalid]
set_property HDL_ATTRIBUTE.DEBUG true [get_bd_nets backstabber_0_wack]
set_property HDL_ATTRIBUTE.MARK_DEBUG true [get_bd_nets backstabber_0_wack]

# ---- address map ----
assign_bd_address -offset 0x0000000000000 -range 2G -target_address_space [get_bd_addr_spaces AXI_PerfectTranslator_0/M00_AXI] [get_bd_addr_segs zynq_ultra_ps_e_0/SAXIGP0/HPC0_DDR_LOW]
assign_bd_address -offset 0x00000C0000000 -range 512M -target_address_space [get_bd_addr_spaces AXI_PerfectTranslator_0/M00_AXI] [get_bd_addr_segs zynq_ultra_ps_e_0/SAXIGP0/HPC0_QSPI]
assign_bd_address -offset 0x00000E0000000 -range 256M -target_address_space [get_bd_addr_spaces AXI_PerfectTranslator_0/M00_AXI] [get_bd_addr_segs zynq_ultra_ps_e_0/SAXIGP0/HPC0_PCIE_LOW]
assign_bd_address -offset 0x00000FF000000 -range 16M -target_address_space [get_bd_addr_spaces AXI_PerfectTranslator_0/M00_AXI] [get_bd_addr_segs zynq_ultra_ps_e_0/SAXIGP0/HPC0_LPS_OCM]
assign_bd_address -offset 0x80000000 -range 64K -target_address_space [get_bd_addr_spaces byte_writer_0/axi] [get_bd_addr_segs byte_writer_0/config_axi/Reg]
assign_bd_address -offset 0x90000000 -range 64K -target_address_space [get_bd_addr_spaces byte_writer_0/axi] [get_bd_addr_segs backstabber_0/config_axi/Reg]
assign_bd_address -offset 0x0080000000 -range 64K -target_address_space [get_bd_addr_spaces zynq_ultra_ps_e_0/Data] [get_bd_addr_segs byte_writer_0/config_axi/Reg]
assign_bd_address -offset 0x0090000000 -range 64K -target_address_space [get_bd_addr_spaces zynq_ultra_ps_e_0/Data] [get_bd_addr_segs backstabber_0/config_axi/Reg]
assign_bd_address -offset 0x00A0000000 -range 4K -target_address_space [get_bd_addr_spaces zynq_ultra_ps_e_0/Data] [get_bd_addr_segs AXI_PerfectTranslator_0/S00_AXI/S00_AXI_mem]

validate_bd_design
save_bd_design
